# EAGLE design GBASP USB-C (EAGLE 6.2)
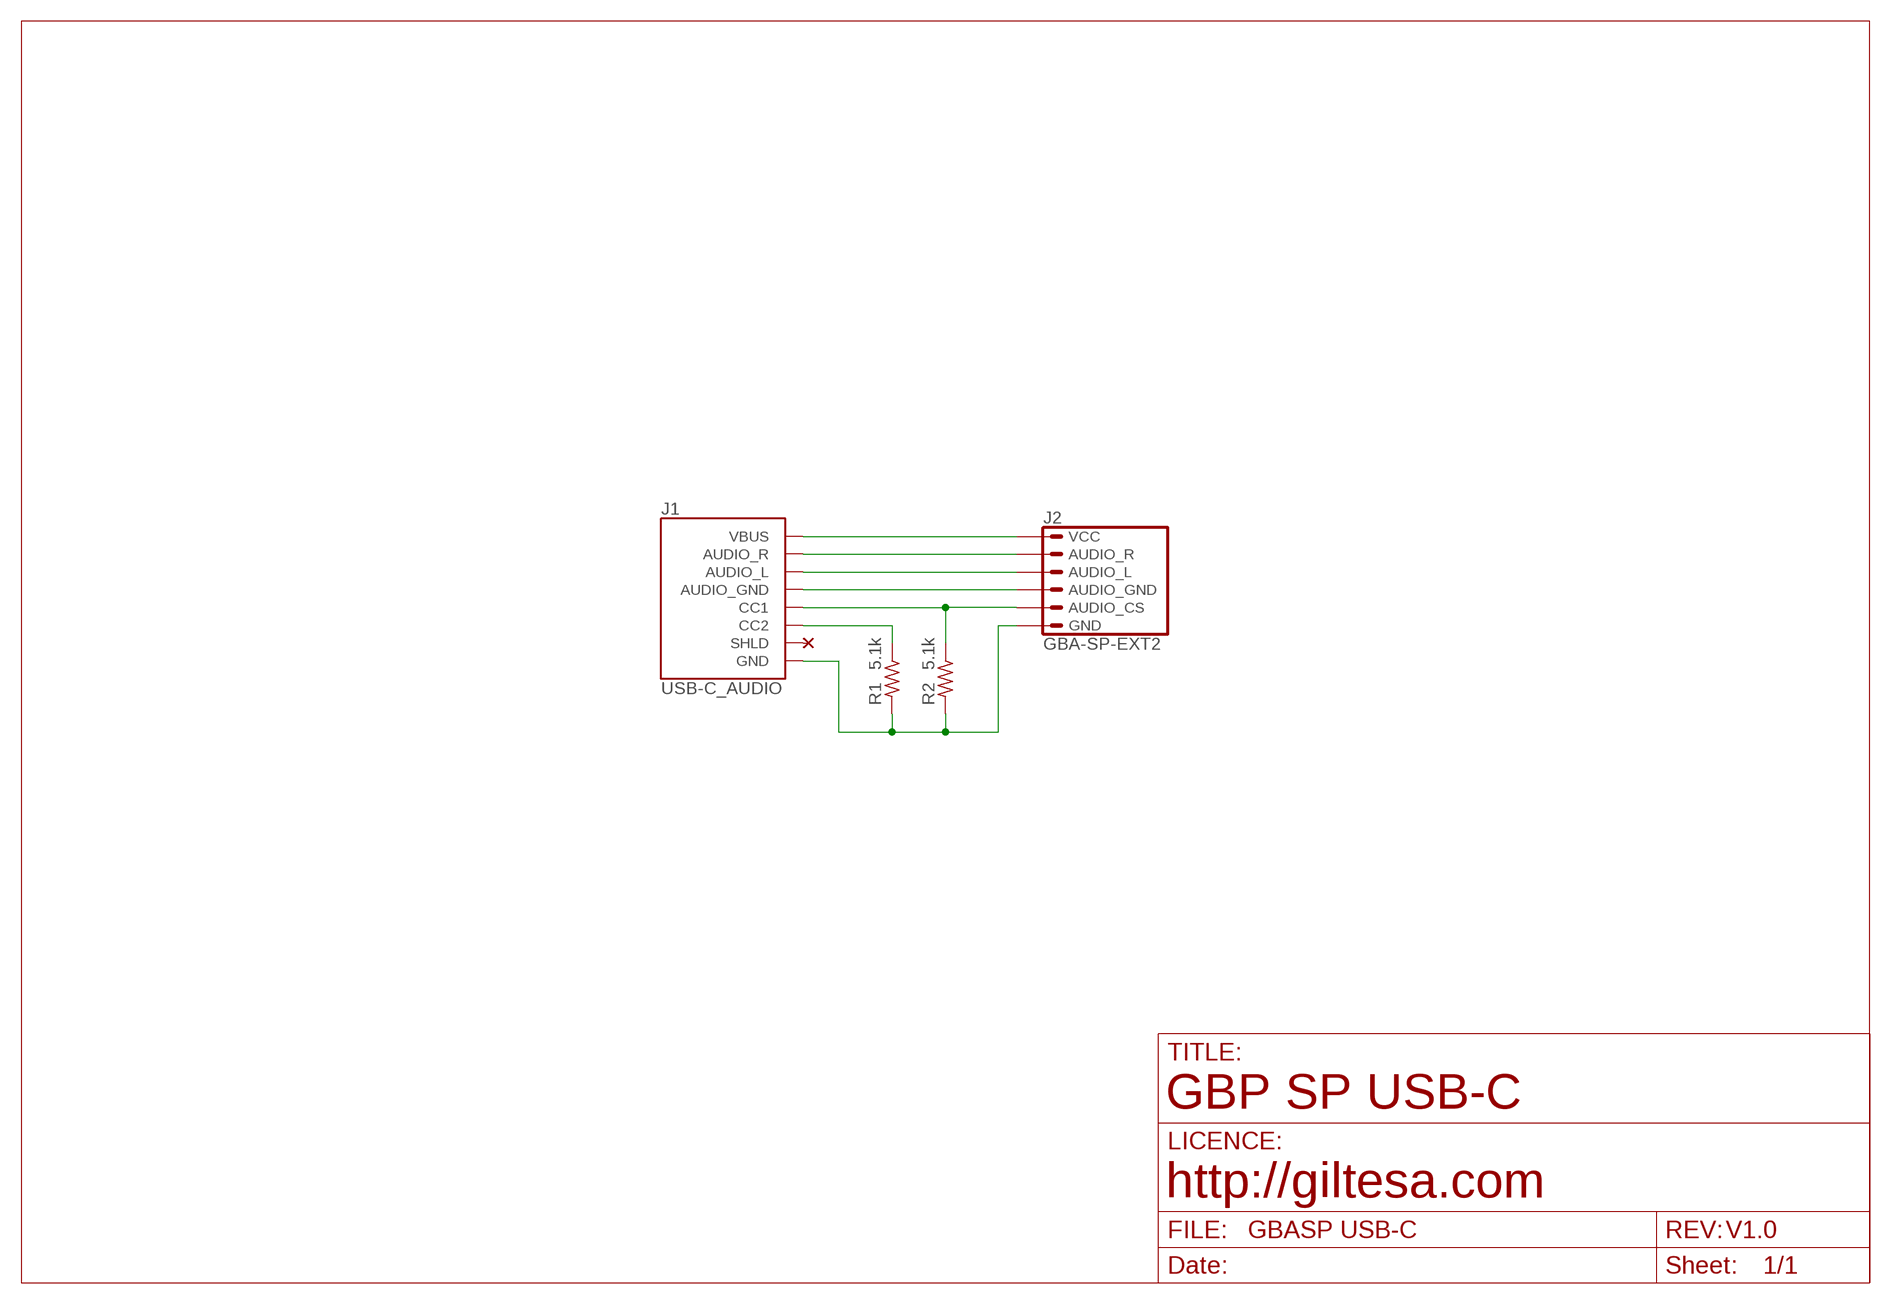
[diagram p0: schematic, sheet 1]

## Parts
J1  USB-C_AUDIO  USB-C_POWER_AUDIOSHLD2  [USB-C_16P_SHLD2]
J2  GBA-SP-EXT2  [GBA-SP-EXT2]
R1  5.1k  R0402  [R0402]
R2  5.1k  R0402  [R0402]

## Nets
AUDIO_GND: J1.A8(AUDIO_GND) J1.B8(AUDIO_GND) J2.AUDIO_GND@1(AUDIO_GND) J2.AUDIO_GND@2(AUDIO_GND)
AUDIO_L: J1.A7(AUDIO_L) J1.B7(AUDIO_L) J2.AUDIO_L@1(AUDIO_L) J2.AUDIO_L@2(AUDIO_L)
AUDIO_R: J1.A6(AUDIO_R) J1.B6(AUDIO_R) J2.AUDIO_R@1(AUDIO_R) J2.AUDIO_R@2(AUDIO_R)
CC1: J1.A5(CC1) J2.AUDIO_CS@1(AUDIO_CS) J2.AUDIO_CS@2(AUDIO_CS) R2.1
CC2: J1.B5(CC2) R1.1
GND: J1.GND J1.GND2(GND) J2.GND@1(GND) J2.GND@2(GND) R1.2 R2.2
VCC: J1.VBUS1(VBUS) J1.VBUS2(VBUS) J2.VCC@1(VCC) J2.VCC@2(VCC)
Unconnected: J1.SHLD1(SHLD) J1.SHLD2(SHLD) J1.SHLD5(SHLD) J1.SHLD6(SHLD) J1.SHLD7(SHLD) J1.SHLD8(SHLD)

## Notes on the sheet
- GBP SP USB-C
- http://giltesa.com
- V1.0

## Library data of the parts
J1 = ,giltesa:USB-C_POWER_AUDIO
J2 = ,giltesa:GBA-SP-EXT2
R1 R2 = ,giltesa:R0402

## Net classes
1 power: width 0.61 mm, drill 0.406 mm, clearance 0.203 mm
2 gnd: width 0.305 mm, drill 0.406 mm, clearance 0.203 mm
3 power usb: width 0.508 mm, drill 0.406 mm, clearance 0.203 mm

## Board
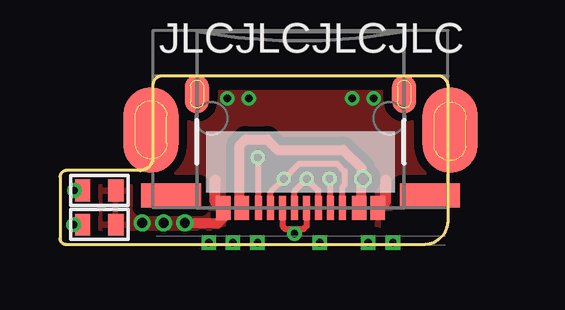
[diagram p1: board, top side]
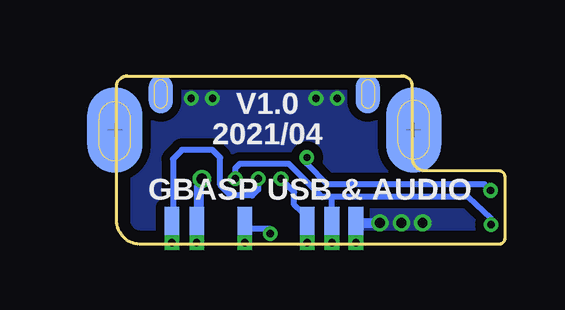
[diagram p2: board, bottom side, seen from below]

Size 16.19 x 7.03 mm. Coordinates in mm from the lower left corner, seen from the top.
Outline: 15.24,0 arc90 16.19,1.07 16.19,6.6 arc90 15.75,7.02 4.32,7.02 arc90 3.87,6.67 3.87,3.63 arc-90 3.33,3.07 0.25,3.07 arc90 0,2.79 0,0.25 arc90 0.25,0 15.24,0
Copper layers (1*16): Top 0.035mm / dielectric 1.6mm / Bottom 0.035mm
Design rules: minimum track width 6mil, minimum drill 12mil, track to track 6mil, track to pad 6mil, pad to pad 6mil, via to via 8mil, smd to smd 0mil, copper to edge 20mil, drill to drill 10mil, minimum pad ring 6mil, minimum via ring 6mil, stop-mask expansion 0mil, vias tented up to drill 100mil, thermal gap 10mil

### Footprints (pad centres in the part's own frame; a part is rotated, then mirrored left to right if it is on the bottom)
USB-C_16P_SHLD2 = smd 0.3 x 1: A5 -1.25,0.005; A6 -0.25,0.005; A7 0.25,0.005; A8 1.25,0.005; B5 1.75,0.005; B6 0.75,0.005; B7 -0.75,0.005; B8 -1.75,0.005 | smd 0.6 x 1: GND -3.225,0.005; GND2 3.225,0.005; VBUS1 -2.45,0.005; VBUS2 2.45,0.005 | smd 2.5 x 1: SHLD1 -5.399,-0.51; SHLD2 5.399,-0.51 | smd 1 x 1.6: SHLD5 4.32,-4.75; SHLD7 -4.32,-4.75 | smd 1 x 1.6 bottom: SHLD6 4.32,-4.75; SHLD8 -4.32,-4.75
GBA-SP-EXT2 = smd 0.61 x 1.778 bottom: AUDIO_CS@1 -2.826,-0.861; AUDIO_GND@1 -1.797,-0.861; AUDIO_L@1 3.854,-0.861; AUDIO_R@1 0.806,-0.861; GND@1 -3.823,-0.861; VCC@1 2.819,-0.861 | drill 0.305 pad 0.61 square: AUDIO_CS@2 -2.826,-1.448; AUDIO_GND@2 -1.797,-1.448; AUDIO_L@2 3.854,-1.448; AUDIO_R@2 0.806,-1.448; GND@2 -3.823,-1.448; VCC@2 2.819,-1.448 | smd 2.286 x 3.556: NC@1 -6.236,3.251; NC@3 6.236,3.251 | smd 2.286 x 3.556 bottom: NC@2 -6.236,3.251; NC@4 6.236,3.251
R0402 = smd 0.635 x 0.9: 1 -0.694,0; 2 0.694,0

### Placement (x,y rotation side)
J1  10.03,1.52 180 top
J2  10.03,1.52 0 top
R1  1.64,2.25 0 top
R2  1.64,0.83 0 top

### Tracks (layer width: path | path; a pad name or v marks a point on that pad's centre or on a via)
AUDIO_GND  (via drill 0.3)
  Top 0.254: 11.81,1.55 J1.B8 11.78,2.38 11.87,2.48 11.87,3.05 11.56,3.37 9.97,3.37 v9.33,2.73 8.78,2.18 J1.A8
  Bottom 0.254: J2.AUDIO_GND@2 J2.AUDIO_GND@1 8.24,1.12 8.78,1.65 8.78,2.18 v9.33,2.73
AUDIO_L  (via drill 0.3)
  Top 0.254: J1.A7 9.78,2.23 v10.29,2.73 10.78,2.23 J1.B7
  Bottom 0.254: J2.AUDIO_L@2 J2.AUDIO_L@1 13.84,0.71 13.84,3.56 13.46,3.94 12.19,3.94 11.87,3.62 11.87,2.48 11.43,2.03 10.54,2.03 10.29,2.29 v10.29,2.73
AUDIO_R  (via drill 0.3)
  Top 0.254: J1.B6 9.28,0.75 9.4,0.64 9.78,0.64 | J1.A6 10.28,0.76 10.16,0.64 9.78,0.64 | 9.78,0.64 v9.78,0.45
  Bottom 0.254: J2.AUDIO_R@2 J2.AUDIO_R@1 | 10.8,1.21 10.8,1.27 10.67,1.4 10.67,1.33 10.8,1.21 | 10.8,1.21 10.8,0.71 J2.AUDIO_R@1 | v9.78,0.45 9.78,0.64 10.81,0.64 J2.AUDIO_R@1
CC1  (via drill 0.3)
  Top 0.254: R2.1 v0.57,0.83 | J1.A5 11.28,2.62 v11.24,2.73
  Bottom 0.254: v0.57,0.83 0.57,1.08 1.52,1.97 7.18,1.97 | J2.AUDIO_CS@2 J2.AUDIO_CS@1 7.21,1.94 7.18,1.97 | v11.24,2.73 11.24,3.17 11.05,3.37 9.02,3.37 7.62,1.97 7.18,1.97
CC2  (via drill 0.3)
  Top 0.254: R1.1 v0.6,2.25 | J1.B5 8.28,3.53 v8.26,3.62
  Bottom 0.254: v0.6,2.25 0.85,2.5 7.39,2.5 8.26,3.37 v8.26,3.62
GND  (via drill 0.3, 0.41)
  Top 0.406: J1.GND 13.26,1.57 13.59,1.78 | 6.81,1.35 J1.GND2 | J1.GND2 6.81,1.57 6.48,1.78 | v5.21,0.89 6.6,0.89 6.81,1.09 J1.GND2
  Top 0.457: 6.48,1.78 6.48,2.67 | 13.59,1.78 13.59,2.67
  Bottom 0.254: J2.GND@2 J2.GND@1 6.2,0.66
  Bottom 0.406: 6.2,0.66 6.2,0.86 6.22,0.89 v5.21,0.89
  other vias: 6.99,6.1 7.87,6.1 12.19,6.1 3.43,0.89 4.32,0.89 13.08,6.1
  pour Top (isolate 0.356): -0.76,7.87 18.29,7.87 18.29,-1.02 -0.76,-1.02
  pour Bottom (isolate 0.356): -0.76,7.87 18.29,7.87 18.29,-1.02 -0.76,-1.02
VCC  (via drill 0.46)
  Top 0.406: J1.VBUS2 7.58,1.69 7.49,1.78 7.49,4.13 7.75,4.38 8.64,4.38 9.08,3.94 11.81,3.94 12.57,3.17 12.57,2.79 v12.64,2.73 12.57,2.67 12.57,1.72 12.48,1.62 J1.VBUS1
  Bottom 0.254: J2.VCC@2 J2.VCC@1
  Bottom 0.406: v12.64,2.73 12.64,2.54 12.76,2.41 12.76,0.75 J2.VCC@1

### Text on the board
tPlace: JLCJLCJLCJLC
bPlace: V1.0 | 2021/04 | GBASP USB & AUDIO